# Altium project AMC_FMC_Carrier v3.PrjPcb (part 14 of 15)

## Sheet FMC_Clocks.SchDoc
size A4; DocumentNumber: 27; SheetNumber: 27; SheetTotal: 30
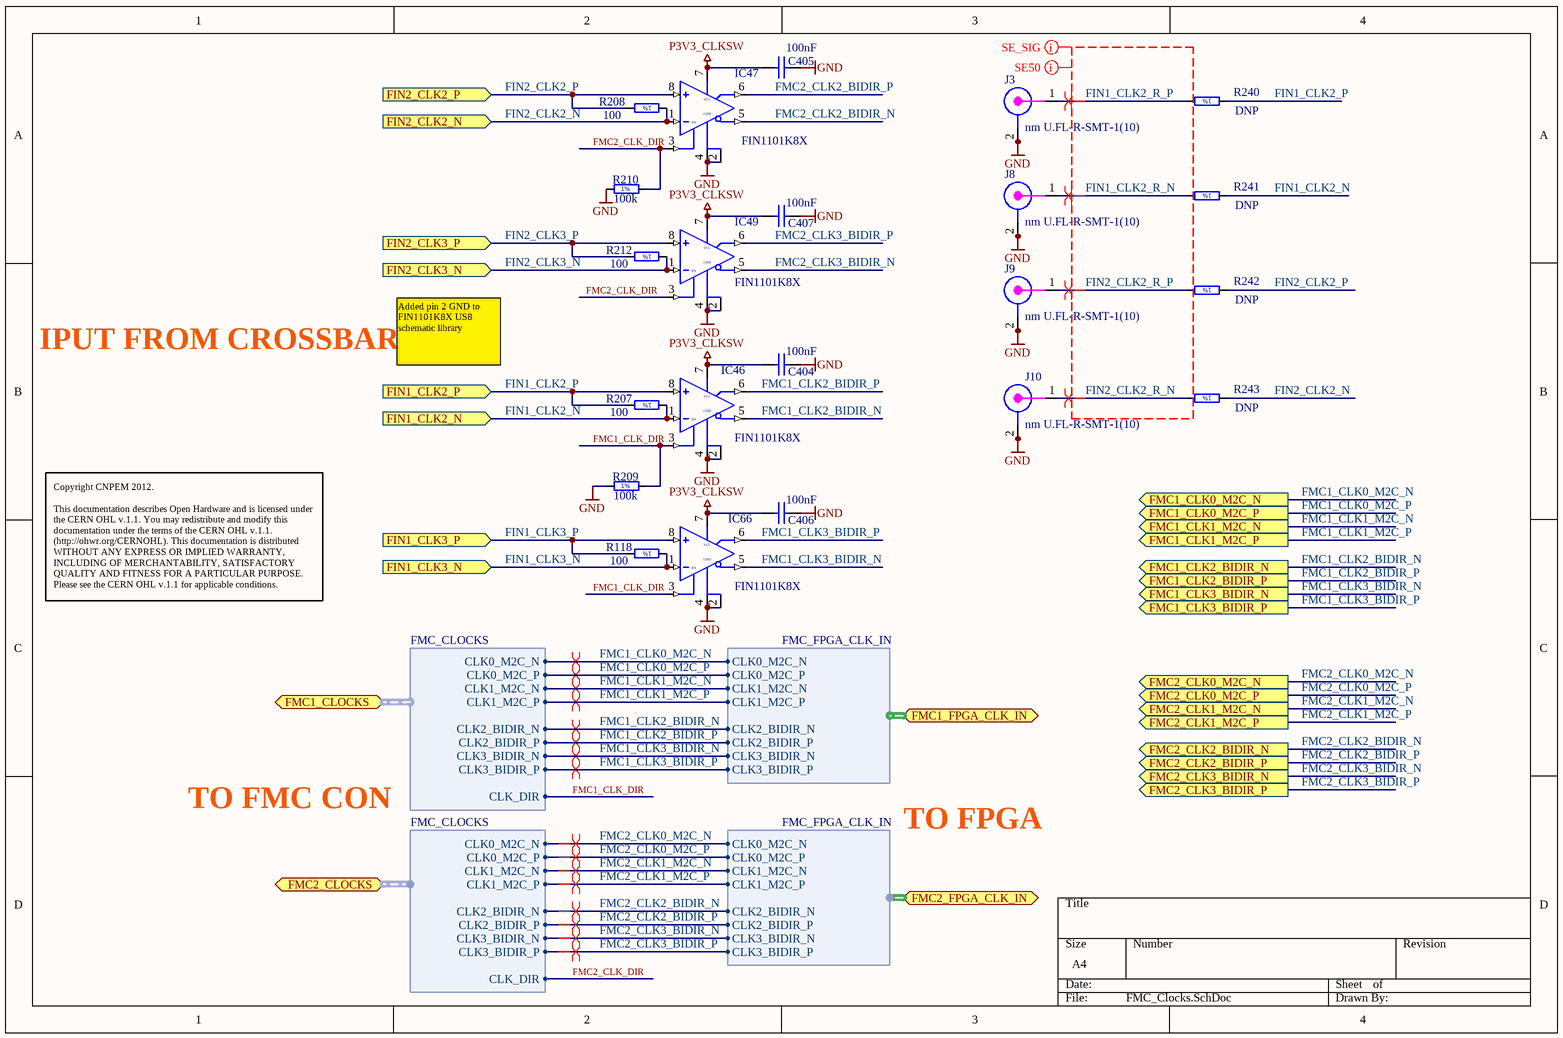
[diagram p30: FMC_Clocks.SchDoc]

### Parts
C404  100nF  [CAPC0603X33N]
C405  100nF  [CAPC0603X33N]
C406  100nF  [CAPC0603X33N]
C407  100nF  [CAPC0603X33N]
IC46  FIN1101K8X  [US8]
IC47  FIN1101K8X  [US8]
IC49  FIN1101K8X  [US8]
IC66  FIN1101K8X  [US8]
J3  nm U.FL-R-SMT-1(10)  [CON_UFL_HIROSE_RECEPTACLE]
J8  nm U.FL-R-SMT-1(10)  [CON_UFL_HIROSE_RECEPTACLE]
J9  nm U.FL-R-SMT-1(10)  [CON_UFL_HIROSE_RECEPTACLE]
J10  nm U.FL-R-SMT-1(10)  [CON_UFL_HIROSE_RECEPTACLE]
R118  100  [RESC1005X40N]
R207  100  [RESC1005X40N]
R208  100  [RESC1005X40N]
R209  100k  [RESC1005X40N]
R210  100k  [RESC1005X40N]
R212  100  [RESC1005X40N]
R240  DNP  [RESC1005X40N]
R241  DNP  [RESC1005X40N]
R242  DNP  [RESC1005X40N]
R243  DNP  [RESC1005X40N]

### Ports
FIN1_CLK2_N (in), FIN1_CLK2_P (in), FIN1_CLK3_N (in), FIN1_CLK3_P (in), FIN2_CLK2_N (in), FIN2_CLK2_P (in), FIN2_CLK3_N (in), FIN2_CLK3_P (in), FMC1_CLK0_M2C_N (out), FMC1_CLK0_M2C_P (out), FMC1_CLK1_M2C_N (out), FMC1_CLK1_M2C_P (out), FMC1_CLK2_BIDIR_N (out), FMC1_CLK2_BIDIR_P (out), FMC1_CLK3_BIDIR_N (out), FMC1_CLK3_BIDIR_P (out), FMC1_CLOCKS (harness FMC_CLOCKS), FMC1_FPGA_CLK_IN (harness FMC_FPGA_CLK_IN), FMC2_CLK0_M2C_N (out), FMC2_CLK0_M2C_P (out), FMC2_CLK1_M2C_N (out), FMC2_CLK1_M2C_P (out), FMC2_CLK2_BIDIR_N (out), FMC2_CLK2_BIDIR_P (out), FMC2_CLK3_BIDIR_N (out), FMC2_CLK3_BIDIR_P (out), FMC2_CLOCKS (harness FMC_CLOCKS), FMC2_FPGA_CLK_IN (harness FMC_FPGA_CLK_IN)

### Harnesses
FMC_CLOCKS: CLK0_M2C_N, CLK0_M2C_P, CLK1_M2C_N, CLK1_M2C_P, CLK_DIR, CLK2_BIDIR_N, CLK2_BIDIR_P, CLK3_BIDIR_N, CLK3_BIDIR_P
FMC_FPGA_CLK_IN: CLK0_M2C_N, CLK0_M2C_P, CLK1_M2C_N, CLK1_M2C_P, CLK2_BIDIR_N, CLK2_BIDIR_P, CLK3_BIDIR_N, CLK3_BIDIR_P

### Nets
GND: C404.2 C405.2 C406.2 C407.2 IC46.2(GND) IC46.4(GND) IC47.2(GND) IC47.4(GND) IC49.2(GND) IC49.4(GND) IC66.2(GND) IC66.4(GND) J3.2 J3.2a(GND) J8.2 J8.2a(GND) J9.2 J9.2a(GND) J10.2 J10.2a(GND) R209.1 R210.1
P3V3_CLKSW: C404.1 C405.1 C406.1 C407.1 IC46.7(VCC) IC47.7(VCC) IC49.7(VCC) IC66.7(VCC)
FIN1_CLK2_N: IC46.1(IN) R207.1 R241.1 ; port FIN1_CLK2_N
FIN1_CLK2_P: IC46.8(IN) R207.2 R240.1 ; port FIN1_CLK2_P
FIN1_CLK2_R_N: J8.1 R241.2
FIN1_CLK2_R_P: J3.1 R240.2
FIN1_CLK3_N: IC66.1(IN) R118.1 ; port FIN1_CLK3_N
FIN1_CLK3_P: IC66.8(IN) R118.2 ; port FIN1_CLK3_P
FIN2_CLK2_N: IC47.1(IN) R208.1 R243.1 ; port FIN2_CLK2_N
FIN2_CLK2_P: IC47.8(IN) R208.2 R242.1 ; port FIN2_CLK2_P
FIN2_CLK2_R_N: J10.1 R243.2
FIN2_CLK2_R_P: J9.1 R242.2
FIN2_CLK3_N: IC49.1(IN) R212.1 ; port FIN2_CLK3_N
FIN2_CLK3_P: IC49.8(IN) R212.2 ; port FIN2_CLK3_P
FMC1_CLK0_M2C_N: port FMC1_CLK0_M2C_N, port FMC1_CLOCKS.CLK0_M2C_N, port FMC1_FPGA_CLK_IN.CLK0_M2C_N  [project net CLKS1.CLK0_M2C_N]
FMC1_CLK0_M2C_P: port FMC1_CLK0_M2C_P, port FMC1_CLOCKS.CLK0_M2C_P, port FMC1_FPGA_CLK_IN.CLK0_M2C_P  [project net CLKS1.CLK0_M2C_P]
FMC1_CLK1_M2C_N: port FMC1_CLK1_M2C_N, port FMC1_CLOCKS.CLK1_M2C_N, port FMC1_FPGA_CLK_IN.CLK1_M2C_N  [project net CLKS1.CLK1_M2C_N]
FMC1_CLK1_M2C_P: port FMC1_CLK1_M2C_P, port FMC1_CLOCKS.CLK1_M2C_P, port FMC1_FPGA_CLK_IN.CLK1_M2C_P  [project net CLKS1.CLK1_M2C_P]
FMC1_CLK2_BIDIR_N: IC46.5(~{Q}) ; port FMC1_CLK2_BIDIR_N, port FMC1_CLOCKS.CLK2_BIDIR_N, port FMC1_FPGA_CLK_IN.CLK2_BIDIR_N  [project net CLKS1.CLK2_BIDIR_N]
FMC1_CLK2_BIDIR_P: IC46.6(Q) ; port FMC1_CLK2_BIDIR_P, port FMC1_CLOCKS.CLK2_BIDIR_P, port FMC1_FPGA_CLK_IN.CLK2_BIDIR_P  [project net CLKS1.CLK2_BIDIR_P]
FMC1_CLK3_BIDIR_N: IC66.5(~{Q}) ; port FMC1_CLK3_BIDIR_N, port FMC1_CLOCKS.CLK3_BIDIR_N, port FMC1_FPGA_CLK_IN.CLK3_BIDIR_N  [project net CLKS1.CLK3_BIDIR_N]
FMC1_CLK3_BIDIR_P: IC66.6(Q) ; port FMC1_CLK3_BIDIR_P, port FMC1_CLOCKS.CLK3_BIDIR_P, port FMC1_FPGA_CLK_IN.CLK3_BIDIR_P  [project net CLKS1.CLK3_BIDIR_P]
FMC1_CLK_DIR: IC46.3(EN) IC66.3(EN) R209.2 ; port FMC1_CLOCKS.CLK_DIR  [project net CLKS1.CLK_DIR]
FMC2_CLK0_M2C_N: port FMC2_CLK0_M2C_N, port FMC2_CLOCKS.CLK0_M2C_N, port FMC2_FPGA_CLK_IN.CLK0_M2C_N  [project net FMCC2.CLK0_M2C_N]
FMC2_CLK0_M2C_P: port FMC2_CLK0_M2C_P, port FMC2_CLOCKS.CLK0_M2C_P, port FMC2_FPGA_CLK_IN.CLK0_M2C_P  [project net FMCC2.CLK0_M2C_P]
FMC2_CLK1_M2C_N: port FMC2_CLK1_M2C_N, port FMC2_CLOCKS.CLK1_M2C_N, port FMC2_FPGA_CLK_IN.CLK1_M2C_N  [project net FMCC2.CLK1_M2C_N]
FMC2_CLK1_M2C_P: port FMC2_CLK1_M2C_P, port FMC2_CLOCKS.CLK1_M2C_P, port FMC2_FPGA_CLK_IN.CLK1_M2C_P  [project net FMCC2.CLK1_M2C_P]
FMC2_CLK2_BIDIR_N: IC47.5(~{Q}) ; port FMC2_CLK2_BIDIR_N, port FMC2_CLOCKS.CLK2_BIDIR_N, port FMC2_FPGA_CLK_IN.CLK2_BIDIR_N  [project net FMCC2.CLK2_BIDIR_N]
FMC2_CLK2_BIDIR_P: IC47.6(Q) ; port FMC2_CLK2_BIDIR_P, port FMC2_CLOCKS.CLK2_BIDIR_P, port FMC2_FPGA_CLK_IN.CLK2_BIDIR_P  [project net FMCC2.CLK2_BIDIR_P]
FMC2_CLK3_BIDIR_N: IC49.5(~{Q}) ; port FMC2_CLK3_BIDIR_N, port FMC2_CLOCKS.CLK3_BIDIR_N, port FMC2_FPGA_CLK_IN.CLK3_BIDIR_N  [project net FMCC2.CLK3_BIDIR_N]
FMC2_CLK3_BIDIR_P: IC49.6(Q) ; port FMC2_CLK3_BIDIR_P, port FMC2_CLOCKS.CLK3_BIDIR_P, port FMC2_FPGA_CLK_IN.CLK3_BIDIR_P  [project net FMCC2.CLK3_BIDIR_P]
FMC2_CLK_DIR: IC47.3(EN) IC49.3(EN) R210.2 ; port FMC2_CLOCKS.CLK_DIR  [project net CLK_DIR]

### Layout directives
differential pair: CLKS1.CLK0_M2C_N, CLKS1.CLK0_M2C_P, CLKS1.CLK1_M2C_N, CLKS1.CLK1_M2C_P, CLKS1.CLK2_BIDIR_N, CLKS1.CLK2_BIDIR_P, CLKS1.CLK3_BIDIR_N, CLKS1.CLK3_BIDIR_P, FIN1_CLK2_R_N, FIN1_CLK2_R_P, FIN2_CLK2_R_N, FIN2_CLK2_R_P, FMCC2.CLK0_M2C_N, FMCC2.CLK0_M2C_P, FMCC2.CLK1_M2C_N, FMCC2.CLK1_M2C_P, FMCC2.CLK2_BIDIR_N, FMCC2.CLK2_BIDIR_P, FMCC2.CLK3_BIDIR_N, FMCC2.CLK3_BIDIR_P
net class SE_SIG: FIN1_CLK2_R_N, FIN1_CLK2_R_P, FIN2_CLK2_R_N, FIN2_CLK2_R_P
net class SE50: FIN1_CLK2_R_N, FIN1_CLK2_R_P, FIN2_CLK2_R_N, FIN2_CLK2_R_P

### Notes on the sheet
- IPUT FROM CROSSBAR
- Added pin 2 GND to FIN1101K8X US8 schematic library
- Copyright CNPEM 2012.
  This documentation describes Open Hardware and is licensed under the CERN OHL v.1.1. You may redistribute and modify this documentation under the terms of the CERN OHL v.1.1. (http://ohwr.org/CERNOHL). This documentation is distributed WITHOUT ANY EXPRESS OR IMPLIED WARRANTY, INCLUDING OF MERCHANTABILITY, SATISFACTORY QUALITY AND FITNESS FOR A PARTICULAR PURPOSE. Please see the CERN OHL v.1.1 for applicable conditions.
- TO FMC CON
- TO FPGA
- (in symbol R0402_0R_JUMPER) 1%
- (in symbol R0402_100K_1%_0.0625W_100PPM) 1%
- (in symbol R0402_100R_1%_0.0625W_100PPM) 1%

### Library data of the parts
C404-C407 = CC0201_100NF_6.3V_10%_X5R: Non-polarised capacitor; Part Description: SMD Multilayer Chip Ceramic Capacitor; Manufacturer: GENERIC; Manufacturer1 Part Number: 02016D104KAT2A; Voltage: 6.3V; TC: X5R; Tolerance: ±10%; Table: Capacitors SMD; Part Number: CC0201_100NF_6.3V_10%_X5R; Component Kind: Standard; Component Type: Standard; Pin Count: 2; Value: 100nF; Status: Not Recommended; Manufacturer Part Number: CC0201_100NF_6.3V_10%_X5R; Case: 0201; Mounted: Yes; Socket: No; SMD: Yes; Manufacturer1 Example: AVX; Manufacturer1 ComponentHeight: 0.33mm; HelpURL: \\cern.ch\dfs\Applications\Altium\Datasheets\CC0201_X5R_AVX.pdf; Author: CERN DEM JLC; CreateDate: 2007-12-03; LatestRevisionDate: 2007-12-03
IC46 IC47 IC49 IC66 = IFC_FIN1101K8X: LVDS TO LVDS repeater3.3V
J3 J8-J10 = CON_UFL_SMD: UFL; Supplier 1: Newark; Supplier Part Number 1: 50P8856
R118 R207 R208 R212 = R0402_100R_1%_0.0625W_100PPM: Resistor - 1%; Part Description: General Purpose Thick Film Chip Resistor; Manufacturer: GENERIC; Manufacturer1 Part Number: 232270671001L; TC: ±100ppm/°C; Table: Resistors SMD; Part Number: R0402_100R_1%_0.0625W_100PPM; Component Kind: Standard; Component Type: Standard; Pin Count: 2; Value: 100; Status: Not recommended; Power: 0.0625W; Tolerance: ±1%; Manufacturer Part Number: R0402_100R_1%_0.0625W_100PPM; Case: 0402; Mounted: Yes; Socket: No; SMD: Yes; Manufacturer1 Example: YAGEO PHYCOMP; Manufacturer1 ComponentHeight: 0.4mm; HelpURL: \\cern.ch\dfs\Applications\Altium\Datasheets\R0402_Phycomp_RC0402.pdf; Author: CERN DEM JLC; CreateDate: 2007-12-03; LatestRevisionDate: 2012-10-17
R209 R210 = R0402_100K_1%_0.0625W_100PPM: Resistor - 1%; Part Description: General Purpose Thick Film Chip Resistor; Manufacturer: GENERIC; Manufacturer1 Part Number: 232270671004L; TC: ±100ppm/°C; Table: Resistors SMD; Part Number: R0402_100K_1%_0.0625W_100PPM; Component Kind: Standard; Component Type: Standard; Pin Count: 2; Value: 100k; Status: Not recommended; Power: 0.0625W; Tolerance: ±1%; Manufacturer Part Number: R0402_100K_1%_0.0625W_100PPM; Case: 0402; Mounted: Yes; Socket: No; SMD: Yes; Manufacturer1 Example: YAGEO PHYCOMP; Manufacturer1 ComponentHeight: 0.4mm; HelpURL: \\cern.ch\dfs\Applications\Altium\Datasheets\R0402_Phycomp_RC0402.pdf; Author: CERN DEM JLC; CreateDate: 2007-12-03; LatestRevisionDate: 2012-10-17
R240-R243 = R0402_0R_JUMPER: Resistor - 1%; Part Description: 1A (0.05R Max DC Resistance) Zero Ohm Jumper; Manufacturer: GENERIC; Manufacturer1 Part Number: 232270591001L; Value: 0; Table: Resistors SMD; Part Number: R0402_0R_JUMPER; Component Kind: Standard; Component Type: Standard; Pin Count: 2; Status: Not recommended; Manufacturer Part Number: R0402_0R_JUMPER; Case: 0402; Mounted: Yes; Socket: No; SMD: Yes; Manufacturer1 Example: YAGEO PHYCOMP; Manufacturer1 ComponentHeight: 0.4mm; HelpURL: \\cern.ch\dfs\Applications\Altium\Datasheets\R0402_Phycomp_RC0402.pdf; Author: CERN DEM JLC; CreateDate: 2007-12-03; LatestRevisionDate: 2012-10-17

## Sheet Low_jitter_CLK_bypass.SchDoc
size A3
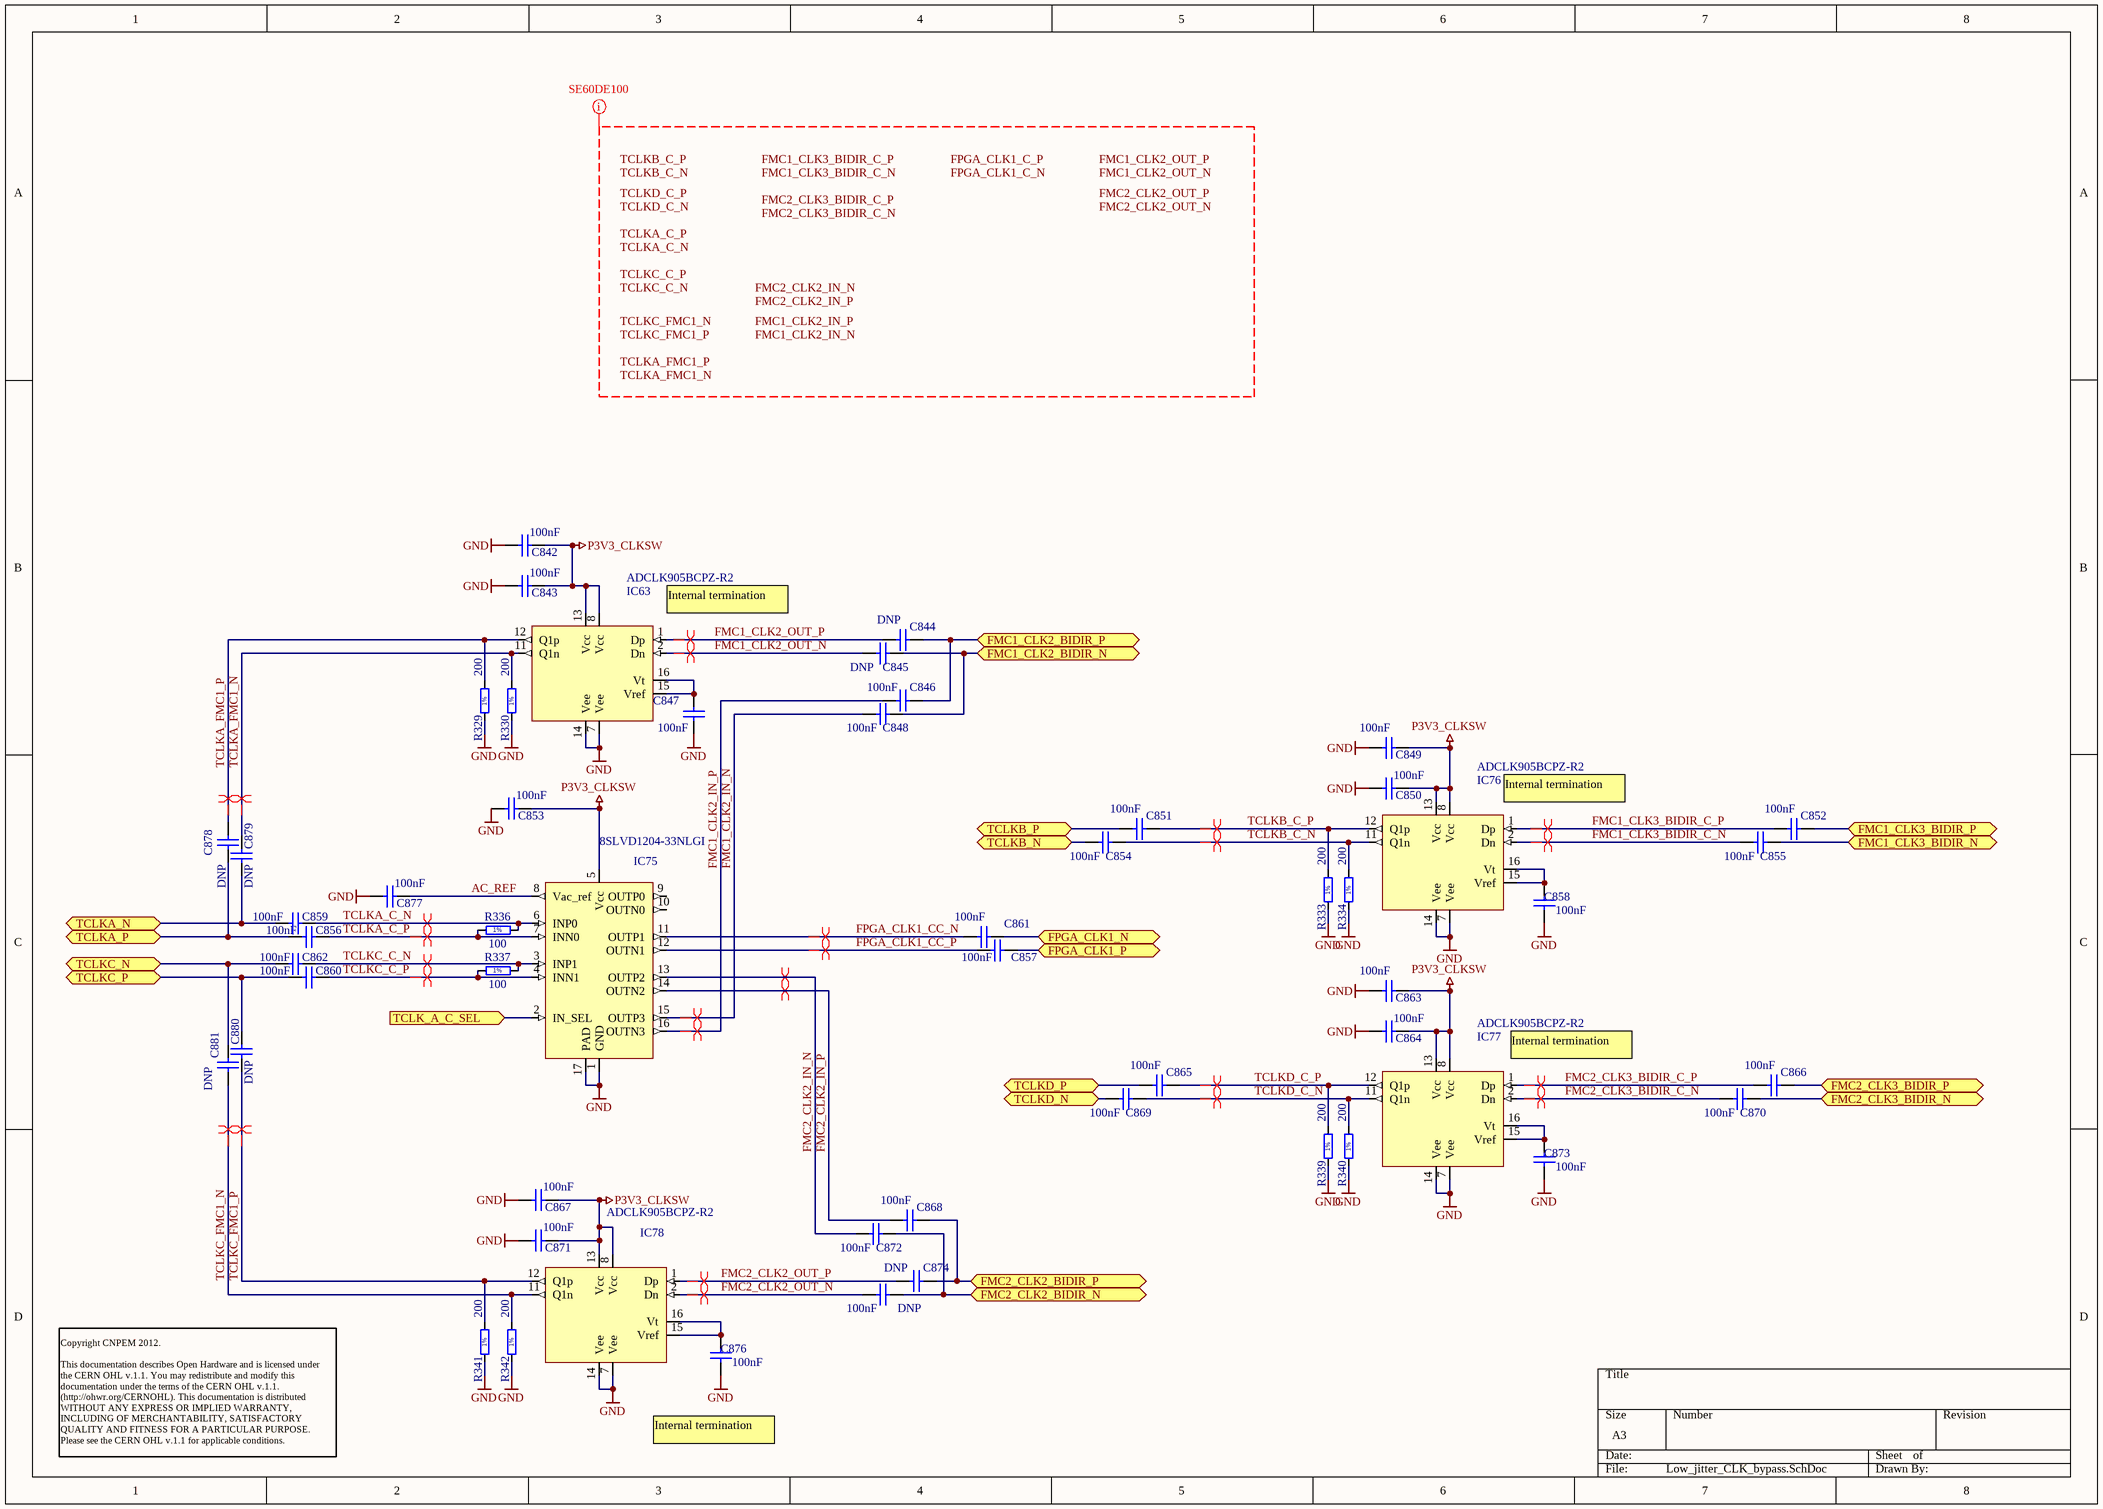
[diagram p31: Low_jitter_CLK_bypass.SchDoc]

### Parts
C842  100nF  [CAPC0603X33N]
C843  100nF  [CAPC0603X33N]
C844  DNP  [CAPC0603X33N]
C845  DNP  [CAPC0603X33N]
C846  100nF  [CAPC0603X33N]
C847  100nF  [CAPC0603X33N]
C848  100nF  [CAPC0603X33N]
C849  100nF  [CAPC0603X33N]
C850  100nF  [CAPC0603X33N]
C851  100nF  [CAPC0603X33N]
C852  100nF  [CAPC0603X33N]
C853  100nF  [CAPC0603X33N]
C854  100nF  [CAPC0603X33N]
C855  100nF  [CAPC0603X33N]
C856  100nF  [CAPC0603X33N]
C857  100nF  [CAPC0603X33N]
C858  100nF  [CAPC0603X33N]
C859  100nF  [CAPC0603X33N]
C860  100nF  [CAPC0603X33N]
C861  100nF  [CAPC0603X33N]
C862  100nF  [CAPC0603X33N]
C863  100nF  [CAPC0603X33N]
C864  100nF  [CAPC0603X33N]
C865  100nF  [CAPC0603X33N]
C866  100nF  [CAPC0603X33N]
C867  100nF  [CAPC0603X33N]
C868  100nF  [CAPC0603X33N]
C869  100nF  [CAPC0603X33N]
C870  100nF  [CAPC0603X33N]
C871  100nF  [CAPC0603X33N]
C872  100nF  [CAPC0603X33N]
C873  100nF  [CAPC0603X33N]
C874  DNP  [CAPC0603X33N]
C876  100nF  [CAPC0603X33N]
C877  100nF  [CAPC0603X33N]
C878  DNP  [CAPC0603X33N]
C879  DNP  [CAPC0603X33N]
C880  DNP  [CAPC0603X33N]
C881  DNP  [CAPC0603X33N]
DNP  100nF  [CAPC0603X33N]
IC63  ADCLK905BCPZ-R2  [CP-16-3]
IC75  8SLVD1204-33NLGI  [QFN50P300X300X100-16N]
IC76  ADCLK905BCPZ-R2  [CP-16-3]
IC77  ADCLK905BCPZ-R2  [CP-16-3]
IC78  ADCLK905BCPZ-R2  [CP-16-3]
R329  200  [RESC1005X40N]
R330  200  [RESC1005X40N]
R333  200  [RESC1005X40N]
R334  200  [RESC1005X40N]
R336  100  [RESC1005X40N]
R337  100  [RESC1005X40N]
R339  200  [RESC1005X40N]
R340  200  [RESC1005X40N]
R341  200  [RESC1005X40N]
R342  200  [RESC1005X40N]

### Ports
FMC1_CLK2_BIDIR_N, FMC1_CLK2_BIDIR_P, FMC1_CLK3_BIDIR_N, FMC1_CLK3_BIDIR_P, FMC2_CLK2_BIDIR_N, FMC2_CLK2_BIDIR_P, FMC2_CLK3_BIDIR_N, FMC2_CLK3_BIDIR_P, FPGA_CLK1_N, FPGA_CLK1_P, TCLK_A_C_SEL (in), TCLKA_N, TCLKA_P, TCLKB_N, TCLKB_P, TCLKC_N, TCLKC_P, TCLKD_N, TCLKD_P

### Nets
GND: C842.1 C843.1 C847.1 C849.1 C850.1 C853.1 C858.1 C863.1 C864.1 C867.1 C871.1 C873.1 C876.1 C877.1 IC63.7(Vee) IC63.14(Vee) IC75.1(GND) IC75.17(PAD) IC76.7(Vee) IC76.14(Vee) IC77.7(Vee) IC77.14(Vee) IC78.7(Vee) IC78.14(Vee) R329.1 R330.1 R333.1 R334.1 R339.1 R340.1 R341.1 R342.1
P3V3_CLKSW: C842.2 C843.2 C849.2 C850.2 C853.2 C863.2 C864.2 C867.2 C871.2 IC63.8(Vcc) IC63.13(Vcc) IC75.5(Vcc) IC76.8(Vcc) IC76.13(Vcc) IC77.8(Vcc) IC77.13(Vcc) IC78.8(Vcc) IC78.13(Vcc)
AC_REF: C877.2 IC75.8(Vac_ref)
CLKS1.CLK2_BIDIR_N: C845.2 C848.2 ; port FMC1_CLK2_BIDIR_N
CLKS1.CLK2_BIDIR_P: C844.2 C846.2 ; port FMC1_CLK2_BIDIR_P
CLKS1.CLK3_BIDIR_N: C855.2 ; port FMC1_CLK3_BIDIR_N
CLKS1.CLK3_BIDIR_P: C852.2 ; port FMC1_CLK3_BIDIR_P
FMC1_CLK2_IN_N: C848.1 IC75.15(OUTP3)
FMC1_CLK2_IN_P: C846.1 IC75.16(OUTN3)
FMC1_CLK2_OUT_N: C845.1 IC63.2(Dn)
FMC1_CLK2_OUT_P: C844.1 IC63.1(Dp)
FMC1_CLK3_BIDIR_C_N: C855.1 IC76.2(Dn)
FMC1_CLK3_BIDIR_C_P: C852.1 IC76.1(Dp)
FMC2_CLK2_IN_N: C872.1 IC75.13(OUTP2)
FMC2_CLK2_IN_P: C868.1 IC75.14(OUTN2)
FMC2_CLK2_OUT_N: DNP.1 IC78.2(Dn)
FMC2_CLK2_OUT_P: C874.1 IC78.1(Dp)
FMC2_CLK3_BIDIR_C_N: C870.1 IC77.2(Dn)
FMC2_CLK3_BIDIR_C_P: C866.1 IC77.1(Dp)
FMCC2.CLK2_BIDIR_N: C872.2 DNP.2 ; port FMC2_CLK2_BIDIR_N
FMCC2.CLK2_BIDIR_P: C868.2 C874.2 ; port FMC2_CLK2_BIDIR_P
FMCC2.CLK3_BIDIR_N: C870.2 ; port FMC2_CLK3_BIDIR_N
FMCC2.CLK3_BIDIR_P: C866.2 ; port FMC2_CLK3_BIDIR_P
FPGA_CLK1_CC_N: C861.1 IC75.11(OUTP1)
FPGA_CLK1_CC_P: C857.1 IC75.12(OUTN1)
FPGA_CLK.FPGA_CLK1_N: C861.2 ; port FPGA_CLK1_N
FPGA_CLK.FPGA_CLK1_P: C857.2 ; port FPGA_CLK1_P
TCLK_A_C_SEL: IC75.2(IN_SEL) ; port TCLK_A_C_SEL
TCLKA_C_N: C859.2 IC75.6(INP0) R336.2
TCLKA_C_P: C856.2 IC75.7(INN0) R336.1
TCLKA_FMC1_N: C879.2 IC63.11(Q1n) R330.2
TCLKA_FMC1_P: C878.2 IC63.12(Q1p) R329.2
TCLKA_N: C859.1 C879.1 ; port TCLKA_N
TCLKA_P: C856.1 C878.1 ; port TCLKA_P
TCLKB_C_N: C854.2 IC76.11(Q1n) R334.2
TCLKB_C_P: C851.2 IC76.12(Q1p) R333.2
TCLKB_N: C854.1 ; port TCLKB_N
TCLKB_P: C851.1 ; port TCLKB_P
TCLKC_C_N: C862.2 IC75.3(INP1) R337.2
TCLKC_C_P: C860.2 IC75.4(INN1) R337.1
TCLKC_FMC1_N: C881.1 IC78.11(Q1n) R342.2
TCLKC_FMC1_P: C880.1 IC78.12(Q1p) R341.2
TCLKC_N: C862.1 C881.2 ; port TCLKC_N
TCLKC_P: C860.1 C880.2 ; port TCLKC_P
TCLKD_C_N: C869.2 IC77.11(Q1n) R340.2
TCLKD_C_P: C865.2 IC77.12(Q1p) R339.2
TCLKD_N: C869.1 ; port TCLKD_N
TCLKD_P: C865.1 ; port TCLKD_P
NetC847_2: C847.2 IC63.15(Vref) IC63.16(Vt)
NetC858_2: C858.2 IC76.15(Vref) IC76.16(Vt)
NetC873_2: C873.2 IC77.15(Vref) IC77.16(Vt)
NetC876_2: C876.2 IC78.15(Vref) IC78.16(Vt)

Not connected (* = marked no-connect by the designer): IC75 9(OUTP0) 10(OUTN0)

### Layout directives
differential pair: FMC1_CLK2_IN_N, FMC1_CLK2_IN_P, FMC1_CLK2_OUT_N, FMC1_CLK2_OUT_P, FMC1_CLK3_BIDIR_C_N, FMC1_CLK3_BIDIR_C_P, FMC2_CLK2_IN_N, FMC2_CLK2_IN_P, FMC2_CLK2_OUT_N, FMC2_CLK2_OUT_P, FMC2_CLK3_BIDIR_C_N, FMC2_CLK3_BIDIR_C_P, FPGA_CLK1_CC_N, FPGA_CLK1_CC_P, TCLKA_C_N, TCLKA_C_P, TCLKA_FMC1_N, TCLKA_FMC1_P, TCLKB_C_N, TCLKB_C_P, TCLKC_C_N, TCLKC_C_P, TCLKC_FMC1_N, TCLKC_FMC1_P, TCLKD_C_N, TCLKD_C_P
net class SE60DE100: FMC1_CLK2_IN_N, FMC1_CLK2_IN_P, FMC1_CLK2_OUT_N, FMC1_CLK2_OUT_P, FMC1_CLK3_BIDIR_C_N, FMC1_CLK3_BIDIR_C_P, FMC2_CLK2_IN_N, FMC2_CLK2_IN_P, FMC2_CLK2_OUT_N, FMC2_CLK2_OUT_P, FMC2_CLK3_BIDIR_C_N, FMC2_CLK3_BIDIR_C_P, FPGA_CLK1_C_N, FPGA_CLK1_C_P, TCLKA_C_N, TCLKA_C_P, TCLKA_FMC1_N, TCLKA_FMC1_P, TCLKB_C_N, TCLKB_C_P, TCLKC_C_N, TCLKC_C_P, TCLKC_FMC1_N, TCLKC_FMC1_P, TCLKD_C_N, TCLKD_C_P

### Notes on the sheet
- (near IC63) Internal termination
- (near IC76) Internal termination
- (near IC77) Internal termination
- Copyright CNPEM 2012.
  This documentation describes Open Hardware and is licensed under the CERN OHL v.1.1. You may redistribute and modify this documentation under the terms of the CERN OHL v.1.1. (http://ohwr.org/CERNOHL). This documentation is distributed WITHOUT ANY EXPRESS OR IMPLIED WARRANTY, INCLUDING OF MERCHANTABILITY, SATISFACTORY QUALITY AND FITNESS FOR A PARTICULAR PURPOSE. Please see the CERN OHL v.1.1 for applicable conditions.
- Internal termination
- Labels drawn without touching a wire or pin: FMC1_CLK2_IN_N, FMC1_CLK2_IN_P, FMC1_CLK2_OUT_N, FMC1_CLK2_OUT_P, FMC1_CLK3_BIDIR_C_N, FMC1_CLK3_BIDIR_C_P, FMC2_CLK2_IN_N, FMC2_CLK2_IN_P, FMC2_CLK2_OUT_N, FMC2_CLK2_OUT_P, FMC2_CLK3_BIDIR_C_N, FMC2_CLK3_BIDIR_C_P, FPGA_CLK1_C_N, FPGA_CLK1_C_P, TCLKA_C_N, TCLKA_C_P, TCLKA_FMC1_N, TCLKA_FMC1_P, TCLKB_C_N, TCLKB_C_P, TCLKC_C_N, TCLKC_C_P, TCLKC_FMC1_N, TCLKC_FMC1_P, TCLKD_C_N, TCLKD_C_P
- (in symbol R0402_100R_1%_0.0625W_100PPM) 1%
- (in symbol R0402_200R_1%_0.0625W_100PPM) 1%

### Library data of the parts
C842 C843 C846-C873 C876 C877 DNP = CC0201_100NF_6.3V_10%_X5R: as C404-C407 on sheet FMC_Clocks; Part Number: CC0201_100NF_6.3V_10%_X5R; Component Kind: Standard; Component Type: Standard; Pin Count: 2; Value: 100nF; Status: Not Recommended; Manufacturer Part Number: CC0201_100NF_6.3V_10%_X5R; Case: 0201; Mounted: Yes; Socket: No; SMD: Yes; Manufacturer1 Example: AVX; Manufacturer1 ComponentHeight: 0.33mm; HelpURL: \\cern.ch\dfs\Applications\Altium\Datasheets\CC0201_X5R_AVX.pdf; Author: CERN DEM JLC; CreateDate: 2007-12-03; LatestRevisionDate: 2007-12-03
C844 C845 C874 C878-C881 = CC0201_100NF_6.3V_10%_X5R: Non-polarised capacitor; Part Description: SMD Multilayer Chip Ceramic Capacitor; Manufacturer: GENERIC; Manufacturer1 Part Number: 02016D104KAT2A; Value: 100nF; Voltage: 6.3V; TC: X5R; Tolerance: ±10%; Table: Capacitors SMD; Part Number: CC0201_100NF_6.3V_10%_X5R; Component Kind: Standard; Component Type: Standard; Pin Count: 2; Status: Not Recommended; Manufacturer Part Number: CC0201_100NF_6.3V_10%_X5R; Case: 0201; Mounted: Yes; Socket: No; SMD: Yes; Manufacturer1 Example: AVX; Manufacturer1 ComponentHeight: 0.33mm; HelpURL: \\cern.ch\dfs\Applications\Altium\Datasheets\CC0201_X5R_AVX.pdf; Author: CERN DEM JLC; CreateDate: 2007-12-03; LatestRevisionDate: 2007-12-03
IC63 IC76-IC78 = CLOCK_ADCLK905: clock distributor
IC75 = CLOCK_IDT8SLVD1204-33: 2:4, LVDS Output Fanout Buffer, 3.3V
R329 R330 R333 R334 R339-R342 = R0402_200R_1%_0.0625W_100PPM: Resistor - 1%; Part Description: General Purpose Thick Film Chip Resistor; Manufacturer: GENERIC; Manufacturer1 Part Number: 232270672001; TC: ±100ppm/°C; Table: Resistors SMD; Part Number: R0402_200R_1%_0.0625W_100PPM; Component Kind: Standard; Component Type: Standard; Pin Count: 2; Value: 200; Status: Not recommended; Power: 0.0625W; Tolerance: ±1%; Manufacturer Part Number: R0402_200R_1%_0.0625W_100PPM; Case: 0402; Mounted: Yes; Socket: No; SMD: Yes; Manufacturer1 Example: PHYCOMP; Manufacturer1 ComponentHeight: 0.4mm; HelpURL: \\cern.ch\dfs\Applications\Altium\Datasheets\R0402_Phycomp_RC0402.pdf; Author: CERN DEM JLC; CreateDate: 03/12/2007; LatestRevisionDate: 13/03/2008
R336 R337 = R0402_100R_1%_0.0625W_100PPM: as R118 on sheet FMC_Clocks; Part Number: R0402_100R_1%_0.0625W_100PPM; Component Kind: Standard; Component Type: Standard; Pin Count: 2; Value: 100; Status: Not recommended; Power: 0.0625W; Tolerance: ±1%; Manufacturer Part Number: R0402_100R_1%_0.0625W_100PPM; Case: 0402; Mounted: Yes; Socket: No; SMD: Yes; Manufacturer1 Example: YAGEO PHYCOMP; Manufacturer1 ComponentHeight: 0.4mm; HelpURL: \\cern.ch\dfs\Applications\Altium\Datasheets\R0402_Phycomp_RC0402.pdf; Author: CERN DEM JLC; CreateDate: 2007-12-03; LatestRevisionDate: 2012-10-17

## Sheet AMC-SATA.SchDoc
size A4; DocumentNumber: 25; SheetNumber: 25; SheetTotal: 30
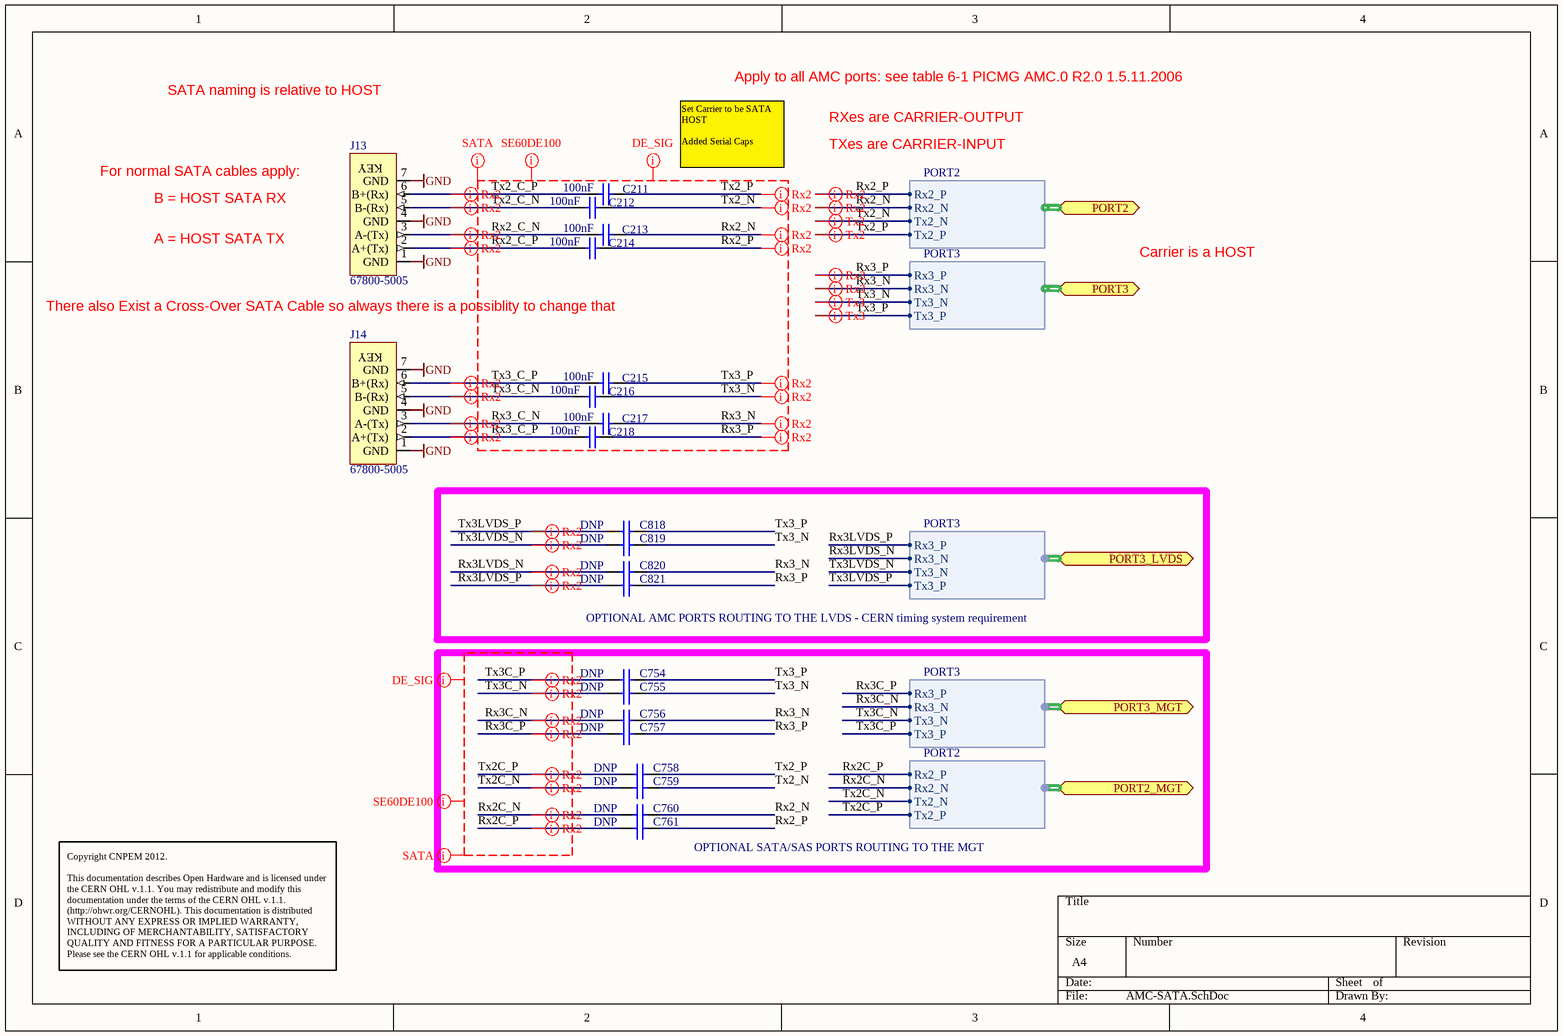
[diagram p32: AMC-SATA.SchDoc]

### Parts
C211  100nF  [CAPC0603X33N]
C212  100nF  [CAPC0603X33N]
C213  100nF  [CAPC0603X33N]
C214  100nF  [CAPC0603X33N]
C215  100nF  [CAPC0603X33N]
C216  100nF  [CAPC0603X33N]
C217  100nF  [CAPC0603X33N]
C218  100nF  [CAPC0603X33N]
C754  DNP  [CAPC0603X33N]
C755  DNP  [CAPC0603X33N]
C756  DNP  [CAPC0603X33N]
C757  DNP  [CAPC0603X33N]
C758  DNP  [CAPC0603X33N]
C759  DNP  [CAPC0603X33N]
C760  DNP  [CAPC0603X33N]
C761  DNP  [CAPC0603X33N]
C818  DNP  [CAPC0603X33N]
C819  DNP  [CAPC0603X33N]
C820  DNP  [CAPC0603X33N]
C821  DNP  [CAPC0603X33N]
J13  67800-5005  [CON_SATA_V]
J14  67800-5005  [CON_SATA_V]

### Blocks framed on the sheet
OPTIONAL SATA/SAS PORTS ROUTING TO THE MGT: C754-C761

### Ports
PORT2 (harness PORT2), PORT2_MGT (harness PORT2), PORT3 (harness PORT3), PORT3_LVDS (harness PORT3), PORT3_MGT (harness PORT3)

### Harnesses
PORT2: Rx2_P, Rx2_N, Tx2_N, Tx2_P
PORT3: Rx3_P, Rx3_N, Tx3_N, Tx3_P

### Nets
GND: J13.1(GND) J13.4(GND) J13.7(GND) J14.1(GND) J14.4(GND) J14.7(GND)
Rx2_C_N: C213.1 J13.3(A-(Tx))
Rx2_C_P: C214.1 J13.2(A+(Tx))
Rx2_N: C213.2 C760.2 ; port PORT2.Rx2_N  [project net PORT2.Rx2_N]
Rx2_P: C214.2 C761.2 ; port PORT2.Rx2_P  [project net PORT2.Rx2_P]
Rx2C_N: C760.1 ; port PORT2_MGT.Rx2_N
Rx2C_P: C761.1 ; port PORT2_MGT.Rx2_P
Rx3_C_N: C217.1 J14.3(A-(Tx))
Rx3_C_P: C218.1 J14.2(A+(Tx))
Rx3_N: C217.2 C756.2 C820.2 ; port PORT3.Rx3_N  [project net PORT3.Rx3_N]
Rx3_P: C218.2 C757.2 C821.2 ; port PORT3.Rx3_P  [project net PORT3.Rx3_P]
Rx3C_N: C756.1 ; port PORT3_MGT.Rx3_N
Rx3C_P: C757.1 ; port PORT3_MGT.Rx3_P
Rx3LVDS_N: C820.1 ; port PORT3_LVDS.Rx3_N  [project net PORT3_LVDS.Rx3_N]
Rx3LVDS_P: C821.1 ; port PORT3_LVDS.Rx3_P  [project net PORT3_LVDS.Rx3_P]
Tx2_C_N: C212.1 J13.5(B-(Rx))
Tx2_C_P: C211.1 J13.6(B+(Rx))
Tx2_N: C212.2 C759.2 ; port PORT2.Tx2_N  [project net PORT2.Tx2_N]
Tx2_P: C211.2 C758.2 ; port PORT2.Tx2_P  [project net PORT2.Tx2_P]
Tx2C_N: C759.1 ; port PORT2_MGT.Tx2_N
Tx2C_P: C758.1 ; port PORT2_MGT.Tx2_P
Tx3_C_N: C216.1 J14.5(B-(Rx))
Tx3_C_P: C215.1 J14.6(B+(Rx))
Tx3_N: C216.2 C755.2 C819.2 ; port PORT3.Tx3_N  [project net PORT3.Tx3_N]
Tx3_P: C215.2 C754.2 C818.2 ; port PORT3.Tx3_P  [project net PORT3.Tx3_P]
Tx3C_N: C755.1 ; port PORT3_MGT.Tx3_N
Tx3C_P: C754.1 ; port PORT3_MGT.Tx3_P
Tx3LVDS_N: C819.1 ; port PORT3_LVDS.Tx3_N  [project net PORT3_LVDS.Tx3_N]
Tx3LVDS_P: C818.1 ; port PORT3_LVDS.Tx3_P  [project net PORT3_LVDS.Tx3_P]

### Layout directives
differential pair: PORT2.Rx2_N, PORT2.Rx2_P, PORT2.Tx2_N, PORT2.Tx2_P, PORT3.Rx3_N, PORT3.Rx3_P, PORT3.Tx3_N, PORT3.Tx3_P, PORT3_LVDS.Rx3_N, PORT3_LVDS.Rx3_P, PORT3_LVDS.Tx3_N, PORT3_LVDS.Tx3_P, Rx2_C_N, Rx2_C_P, Rx2C_N, Rx2C_P, Rx3_C_N, Rx3_C_P, Rx3C_N, Rx3C_P, Tx2_C_N, Tx2_C_P, Tx2C_N, Tx2C_P, Tx3_C_N, Tx3_C_P, Tx3C_N, Tx3C_P
net class SATA: Rx2_C_N, Rx2_C_P, Rx2_N, Rx2_P, Rx2C_N, Rx2C_P, Rx3_C_N, Rx3_C_P, Rx3_N, Rx3_P, Rx3C_N, Rx3C_P, Tx2_C_N, Tx2_C_P, Tx2_N, Tx2_P, Tx2C_N, Tx2C_P, Tx3_C_N, Tx3_C_P, Tx3_N, Tx3_P, Tx3C_N, Tx3C_P
net class SE60DE100: Rx2_C_N, Rx2_C_P, Rx2_N, Rx2_P, Rx2C_N, Rx2C_P, Rx3_C_N, Rx3_C_P, Rx3_N, Rx3_P, Rx3C_N, Rx3C_P, Tx2_C_N, Tx2_C_P, Tx2_N, Tx2_P, Tx2C_N, Tx2C_P, Tx3_C_N, Tx3_C_P, Tx3_N, Tx3_P, Tx3C_N, Tx3C_P
net class DE_SIG: Rx2_C_N, Rx2_C_P, Rx2_N, Rx2_P, Rx2C_N, Rx2C_P, Rx3_C_N, Rx3_C_P, Rx3_N, Rx3_P, Rx3C_N, Rx3C_P, Tx2_C_N, Tx2_C_P, Tx2_N, Tx2_P, Tx2C_N, Tx2C_P, Tx3_C_N, Tx3_C_P, Tx3_N, Tx3_P, Tx3C_N, Tx3C_P

### Notes on the sheet
- SATA naming is relative to HOST
- Apply to all AMC ports: see table 6-1 PICMG AMC.0 R2.0 1.5.11.2006
- For normal SATA cables apply:
- Set Carrier to be SATA HOST
  Added Serial Caps
- RXes are CARRIER-OUTPUT
- TXes are CARRIER-INPUT
- A = HOST SATA TX
- B = HOST SATA RX
- There also Exist a Cross-Over SATA Cable so always there is a possiblity to change that
- Carrier is a HOST
- OPTIONAL AMC PORTS ROUTING TO THE LVDS - CERN timing system requirement
- Copyright CNPEM 2012.
  This documentation describes Open Hardware and is licensed under the CERN OHL v.1.1. You may redistribute and modify this documentation under the terms of the CERN OHL v.1.1. (http://ohwr.org/CERNOHL). This documentation is distributed WITHOUT ANY EXPRESS OR IMPLIED WARRANTY, INCLUDING OF MERCHANTABILITY, SATISFACTORY QUALITY AND FITNESS FOR A PARTICULAR PURPOSE. Please see the CERN OHL v.1.1 for applicable conditions.
- (in symbol CON_SATA_V) KEY

### Library data of the parts
C211-C218 = CC0201_100NF_6.3V_10%_X5R: as C404-C407 on sheet FMC_Clocks; Part Number: CC0201_100NF_6.3V_10%_X5R; Component Kind: Standard; Component Type: Standard; Pin Count: 2; Value: 100nF; Status: Not Recommended; Manufacturer Part Number: CC0201_100NF_6.3V_10%_X5R; Case: 0201; Mounted: Yes; Socket: No; SMD: Yes; Manufacturer1 Example: AVX; Manufacturer1 ComponentHeight: 0.33mm; HelpURL: \\cern.ch\dfs\Applications\Altium\Datasheets\CC0201_X5R_AVX.pdf; Author: CERN DEM JLC; CreateDate: 2007-12-03; LatestRevisionDate: 2007-12-03
C754-C761 C818-C821 = CC0201_100NF_6.3V_10%_X5R: as C844 on sheet Low_jitter_CLK_bypass; Part Number: CC0201_100NF_6.3V_10%_X5R; Component Kind: Standard; Component Type: Standard; Pin Count: 2; Status: Not Recommended; Manufacturer Part Number: CC0201_100NF_6.3V_10%_X5R; Case: 0201; Mounted: Yes; Socket: No; SMD: Yes; Manufacturer1 Example: AVX; Manufacturer1 ComponentHeight: 0.33mm; HelpURL: \\cern.ch\dfs\Applications\Altium\Datasheets\CC0201_X5R_AVX.pdf; Author: CERN DEM JLC; CreateDate: 2007-12-03; LatestRevisionDate: 2007-12-03
J13 J14 = CON_SATA_V: SATA conenctor  PCB Molex